# EAGLE schematic HVPulser0_3UCC21520 (EAGLE 8.2.2)
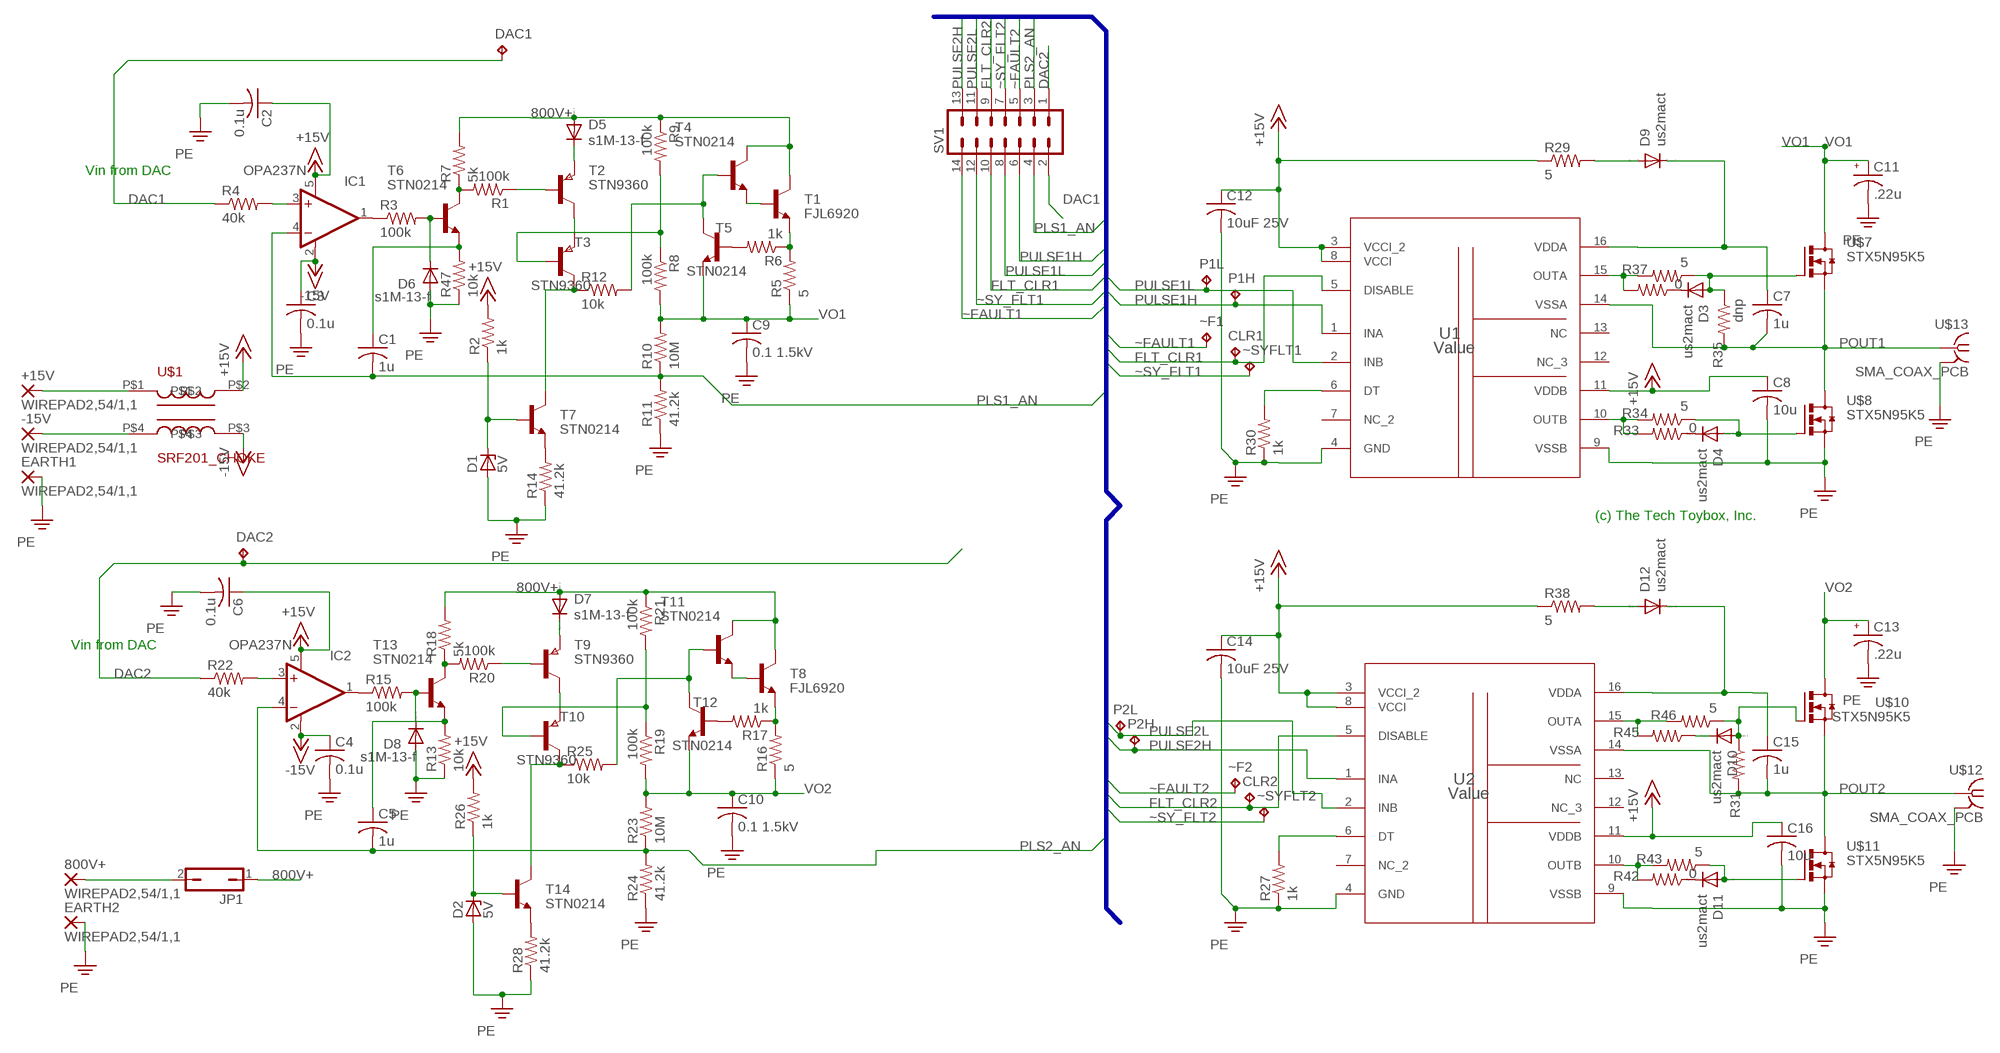
[diagram p0: schematic, sheet 1]

## Parts
800V+  WIREPAD2,54/1,1  [2,54/1,1]
+15V  WIREPAD2,54/1,1  [2,54/1,1]
-15V  WIREPAD2,54/1,1  [2,54/1,1]
C1  1u  C-USC0805  [C0805]
C2  0.1u  C-USC0805  [C0805]
C3  0.1u  C-USC0805  [C0805]
C4  0.1u  C-USC0805  [C0805]
C5  1u  C-USC0805  [C0805]
C6  0.1u  C-USC0805  [C0805]
C7  1u  C-USC0805  [C0805]
C8  10u  C-USC1210  [C1210]
C9  0.1 1.5kV  C-USC2225K  [C2225K]
C10  0.1 1.5kV  C-USC2225K  [C2225K]
C11  .22u  C-US050-035X075  [C050-035X075]
C12  10uF 25V  C-USC0805  [C0805]
C13  .22u  C-US050-035X075  [C050-035X075]
C14  10uF 25V  C-USC0805  [C0805]
C15  1u  C-USC0805  [C0805]
C16  10u  C-USC1210  [C1210]
CLR1  TPTP10R  [TP10R]
CLR2  TPTP10R  [TP10R]
D1  5V  ZENER-DIODEDO41Z10  [DO41Z10]
D2  5V  ZENER-DIODEDO41Z10  [DO41Z10]
D3  us2mact  DIODE-DO214AC  [DO214AC]
D4  us2mact  DIODE-DO214AC  [DO214AC]
D5  s1M-13-f  DIODE-DO214AC  [DO214AC]
D6  s1M-13-f  DIODE-DO214AC  [DO214AC]
D7  s1M-13-f  DIODE-DO214AC  [DO214AC]
D8  s1M-13-f  DIODE-DO214AC  [DO214AC]
D9  us2mact  DIODE-DO214AC  [DO214AC]
D10  us2mact  DIODE-DO214AC  [DO214AC]
D11  us2mact  DIODE-DO214AC  [DO214AC]
D12  us2mact  DIODE-DO214AC  [DO214AC]
DAC1  TPTP10R  [TP10R]
DAC2  TPTP10R  [TP10R]
EARTH1  WIREPAD2,54/1,1  [2,54/1,1]
EARTH2  WIREPAD2,54/1,1  [2,54/1,1]
IC1  OPA237N  [SOT23-5]
IC2  OPA237N  [SOT23-5]
JP1  JP1Q  [JP1]
P1H  TPTP10R  [TP10R]
P1L  TPTP10R  [TP10R]
P2H  TPTP10R  [TP10R]
P2L  TPTP10R  [TP10R]
R1  100k  R-US_0613/15  [P0613/15]
R2  1k  R-US_0613/15  [P0613/15]
R3  100k  R-US_R0603  [R0603]
R4  40k  R-US_R0603  [R0603]
R5  5  R-US_0613/15  [P0613/15]
R6  1k  R-US_0613/15  [P0613/15]
R7  5k  R-US_R0603  [R0603]
R8  100k  R-US_0613/15  [P0613/15]
R9  100k  R-US_0613/15  [P0613/15]
R10  10M  R-US_0613/15  [P0613/15]
R11  41.2k  R-US_0613/15  [P0613/15]
R12  10k  R-US_R0603  [R0603]
R13  10k  R-US_R0805  [R0805]
R14  41.2k  R-US_0613/15  [P0613/15]
R15  100k  R-US_R0603  [R0603]
R16  5  R-US_0613/15  [P0613/15]
R17  1k  R-US_0613/15  [P0613/15]
R18  5k  R-US_R0603  [R0603]
R19  100k  R-US_0613/15  [P0613/15]
R20  100k  R-US_0613/15  [P0613/15]
R21  100k  R-US_0613/15  [P0613/15]
R22  40k  R-US_R0603  [R0603]
R23  10M  R-US_0613/15  [P0613/15]
R24  41.2k  R-US_0613/15  [P0613/15]
R25  10k  R-US_R0603  [R0603]
R26  1k  R-US_0613/15  [P0613/15]
R27  1k  R-US_R0805  [R0805]
R28  41.2k  R-US_0613/15  [P0613/15]
R29  5  R-US_0207/10  [0207/10]
R30  1k  R-US_R0805  [R0805]
R31  15  R-US_R0805  [R0805]
R33  0  R-US_R0805  [R0805]
R34  5  R-US_R0805  [R0805]
R35  dnp  R-US_R0805  [R0805]
R36  0  R-US_R0805  [R0805]
R37  5  R-US_R0805  [R0805]
R38  5  R-US_0207/10  [0207/10]
R42  0  R-US_R0805  [R0805]
R43  5  R-US_R0805  [R0805]
R45  15  R-US_R0805  [R0805]
R46  5  R-US_R0805  [R0805]
R47  10k  R-US_R0805  [R0805]
SV1  MA07-2  [MA07-2]
T1  FJL6920  FJL6920-NPN_POWER  [TO264V]
T2  STN9360  PNPSOT223  [SOT223]
T3  STN9360  PNPSOT223  [SOT223]
T4  STN0214  -NPN-SOT223  [SOT223]
T5  STN0214  -NPN-SOT223  [SOT223]
T6  STN0214  -NPN-SOT223  [SOT223]
T7  STN0214  -NPN-SOT223  [SOT223]
T8  FJL6920  FJL6920-NPN_POWER  [TO264V]
T9  STN9360  PNPSOT223  [SOT223]
T10  STN9360  PNPSOT223  [SOT223]
T11  STN0214  -NPN-SOT223  [SOT223]
T12  STN0214  -NPN-SOT223  [SOT223]
T13  STN0214  -NPN-SOT223  [SOT223]
T14  STN0214  -NPN-SOT223  [SOT223]
U1  Value  UCC21520ADWR  [DW0016A_N]
U2  Value  UCC21520ADWR  [DW0016A_N]
U$1  SRF201_CHOKE  [CHOKE_BOURNES_SRF2012]
U$7  STX5N95K5  [TO220AV]
U$8  STX5N95K5  [TO220AV]
U$10  STX5N95K5  [TO220AV]
U$11  STX5N95K5  [TO220AV]
U$12  SMA_COAX_PCB  [SMA-COAX-V-TECONNECT]
U$13  SMA_COAX_PCB  [SMA-COAX-V-TECONNECT]
~F1  TPTP10R  [TP10R]
~F2  TPTP10R  [TP10R]
~SYFLT1  TPTP10R  [TP10R]
~SYFLT2  TPTP10R  [TP10R]

## Nets
800V+: D5.A D7.A JP1.1 R7.2 R9.1 R18.2 R21.1 T1.2(C) T4.4(C) T8.2(C) T11.4(C)
+15V: C2.1 C6.1 C8.1 C12.1 C14.1 C16.1 IC1.5(V+) IC2.5(V+) R2.2 R26.2 R29.1 R38.1 U1.3(VCCI_2) U1.8(VCCI) U1.11(VDDB) U2.3(VCCI_2) U2.8(VCCI) U2.11(VDDB) U$1.P$2
+800VIN: 800V+.1(P) JP1.2
-15V: C3.1 C4.1 IC1.2(V-) IC2.2(V-) U$1.P$3
DAC1: DAC1.TP R4.1 SV1.2
DAC2: DAC2.TP R22.1 SV1.1
FLT_CLR1: CLR1.TP SV1.10 U1.5(DISABLE)
FLT_CLR2: CLR2.TP SV1.9 U2.5(DISABLE)
N$1: -15V.1(P) U$1.P$4
N$2: +15V.1(P) U$1.P$1
N$3: C1.1 R47.2 T6.3(E)
N$4: C5.1 R13.2 T13.3(E)
N$5: D3.C R36.1
N$6: D3.A R35.1 R37.1 U$7.1(G)
N$7: R36.2 R37.2 U1.15(OUTA)
N$8: D4.C R33.1
N$9: R33.2 R34.2 U1.10(OUTB)
N$10: D10.C R45.1
N$11: D9.A R29.2
N$12: D4.A R34.1 U$8.1(G)
N$13: R45.2 R46.2 U2.15(OUTA)
N$14: D11.C R42.1
N$15: R42.2 R43.2 U2.10(OUTB)
N$16: D11.A R43.1 U$11.1(G)
N$17: R30.2 U1.6(DT)
N$18: D12.A R38.2
N$19: R27.2 U2.6(DT)
N$22: IC1.1(OUT) R3.1
N$23: T2.2(C) T2.4(C) T3.3(E)
N$24: R1.1 T2.1(B)
N$25: D5.C T2.3(E)
N$26: D6.C R3.2 T6.1(B)
N$27: IC1.3(+IN) R4.2
N$29: R5.2 R6.1 T1.3(E)
N$30: T1.1(B) T4.3(E)
N$31: R12.2 T4.1(B) T5.4(C)
N$32: R6.2 T5.1(B)
N$33: R8.1 R9.2 T3.1(B)
N$34: R1.2 R7.1 T6.4(C)
N$35: R12.1 T3.2(C) T3.4(C) T7.4(C)
N$36: R14.2 T7.3(E)
N$37: IC2.1(OUT) R15.1
N$38: D1.C R2.1 T7.1(B)
N$39: T9.2(C) T9.4(C) T10.3(E)
N$40: R16.2 R17.1 T8.3(E)
N$41: T8.1(B) T11.3(E)
N$42: R17.2 T12.1(B)
N$43: R19.1 R21.2 T10.1(B)
N$44: R20.1 T9.1(B)
N$45: D7.C T9.3(E)
N$46: R25.2 T11.1(B) T12.4(C)
N$47: D8.C R15.2 T13.1(B)
N$48: R18.1 R20.2 T13.4(C)
N$50: IC2.3(+IN) R22.2
N$51: R25.1 T10.2(C) T10.4(C) T14.4(C)
N$52: R28.2 T14.3(E)
N$53: D2.C R26.1 T14.1(B)
N$69: D10.A R31.1 R46.1 U$10.1(G)
PE: C2.2 C3.2 C4.2 C6.2 C8.2 C9.2 C10.2 C11.2 C12.2 C13.2 C14.2 C16.2 D1.A D2.A D6.A D8.A EARTH1.1(P) EARTH2.1(P) R11.1 R13.1 R14.1 R24.1 R27.1 R28.1 R30.1 R47.1 U1.4(GND) U1.9(VSSB) U2.4(GND) U2.9(VSSB) U$8.3(S) U$11.3(S) U$12.2 U$12.3 U$12.4 U$12.5 U$13.2 U$13.3 U$13.4 U$13.5
PLS1_AN: C1.2 IC1.4(-IN) R10.1 R11.2 SV1.4
PLS2_AN: C5.2 IC2.4(-IN) R23.1 R24.2 SV1.3
POUT1: C7.2 R35.2 U1.14(VSSA) U$7.3(S) U$8.2(D) U$13.1
POUT2: C15.2 R31.2 U2.14(VSSA) U$10.3(S) U$11.2(D) U$12.1
PULSE1H: P1H.TP SV1.6 U1.1(INA)
PULSE1L: P1L.TP SV1.8 U1.2(INB)
PULSE2H: P2H.TP SV1.13 U2.1(INA)
PULSE2L: P2L.TP SV1.11 U2.2(INB)
VB3: C7.1 D9.C U1.16(VDDA)
VB4: C15.1 D12.C U2.16(VDDA)
VO1: C9.1 C11.1 R5.1 R8.2 R10.2 T5.3(E) U$7.2(D)
VO2: C10.1 C13.1 R16.1 R19.2 R23.2 T12.3(E) U$10.2(D)
~FAULT1: SV1.14 ~F1.TP
~FAULT2: SV1.5 ~F2.TP
~SY_FLT1: SV1.12 ~SYFLT1.TP
~SY_FLT2: SV1.7 ~SYFLT2.TP
Unconnected: U1.7(NC_2) U1.12(NC_3) U1.13(NC) U2.7(NC_2) U2.12(NC_3) U2.13(NC)

## Buses
PULSE1H,PULSE1L,~FAULT1,~SY_FLT1,FLT_CLR1,PLS1_AN,PULSE2H,PULSE2L,~FAULT2,~SY_FLT2,FLT_CLR2,PLS2_AN,SCL,SDA,*LDAC1,RDY1,DBD_EN,DBD_PULSE,DBD_AN,MCLR,PGED,PGEC,USB_N,USB_P,VBUS,BUSB3V3,USBID,U2TX,U2RX,DET_PULSE,SD_WP,SD_CS,SD_SDI1,SD_SDO1,SD_SCK1,SD_CD,VDD,VSS

## Notes on the sheet
- Vin from DAC
- (c) The Tech Toybox, Inc.
- Vin from DAC

## Library data of the parts
800V+ +15V -15V EARTH1 EARTH2 = wirepad:WIREPAD: Wire PAD connect wire on PCB
C1-C10 C12 C14-C16 = rcl:C-US: CAPACITOR, American symbol
C11 C13 = UserMark:C-US: CAPACITOR, American symbol; PARTNO: C1608X7R1H224K080AB
CLR1 CLR2 DAC1 DAC2 P1H P1L P2H P2L ~F1 ~F2 ~SYFLT1 ~SYFLT2 = testpad:TP: Test pad
D1 D2 = diode:ZENER-DIODE: Z-Diode
D3-D12 = diode:DIODE-: DIODE
IC1 IC2 = burr-brown:OPA237: Operational Amplifiers Single-Supply, MicroAmplifier(TM) Series; MF: TEXAS INSTRUMENTS; MPN: OPA237NA/250; OC_FARNELL: 4625298; OC_NEWARK: 35C1874
JP1 = jumper:JP1Q: JUMPER
R1-R31 R33-R38 R42 R43 R45-R47 = rcl:R-US_: RESISTOR, American symbol
SV1 = UserMark:MA07-2: PIN HEADER; OC_FARNELL: unknown; OC_NEWARK: unknown
T1 T8 = UserMark:FJL6920-NPN_POWER
T2 T3 T9 T10 = zetex:PNPSOT223: PNP TRANSISTOR; MPN: DJT4030P-13; OC_FARNELL: 1710675; OC_NEWARK: 25R4489
T4-T7 T11-T14 = transistor-neu-to92:*-NPN-: NPN Transistror
U1 U2 = UserMark:UCC21520ADWR; MANUFACTURER: Texas Instruments; PARTNUMBER: UCC21520ADWR; REFDES: RefDes; TYPE: TYPE
U$1 = UserMark:SRF201_CHOKE
U$7 U$8 U$10 U$11 = UserMark:STX5N95K5
U$12 U$13 = UserMark:SMA_COAX_PCB